# Altium schematic sheet batt_power.SchDoc: Battery and regulation
size A4; Author: Samuel López; DocumentNumber: 4; SheetNumber: 4; SheetTotal: 5
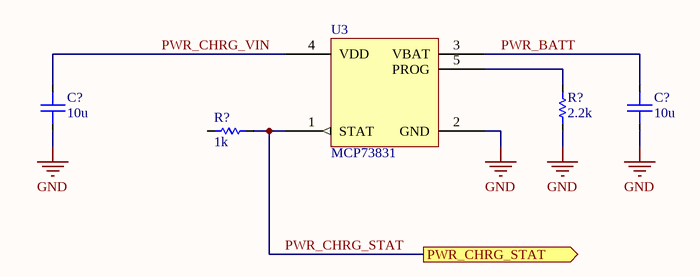
[diagram p0: batt_power.SchDoc]

## Parts
(Parts that share a designator on the sheet are numbered #1, #2 ... from top to bottom, then left to right.)
C?#1  10u  [C0603]
C?#2  10u  [C0603]
R?#1  2.2k  [R0402]
R?#2  1k  [R0402]
U3  MCP73831  [MCP7383X]

## Ports
PWR_CHRG_STAT (out)

## Nets
GND: C?#1.1 C?#2.1 R?#1.2 U3.2(GND)
PWR_BATT: C?#2.2 U3.3(VBAT)
PWR_CHRG_STAT: R?#2.1 U3.1(STAT) ; port PWR_CHRG_STAT
PWR_CHRG_VIN: C?#1.2 U3.4(VDD)
NetR?#1_1: R?#1.1 U3.5(PROG)

Not connected (* = marked no-connect by the designer): R?#2 2

## Notes on the sheet
- Title:
- Sheet
- of
- Author:
- Date:
- Time:

## Library data of the parts
C?#1 C?#2 = Capacitor: Value: 10u; Rated Voltage: *
R?#1 R?#2 = Resistor: Power: *
  R?#1: Value: 2.2k
  R?#2: Value: 1k
U3 = MCP73831: IC - Battery Charger, Single Cell Li-Ion/LiPo, 0.5A; Supplier 1: Digi-Key; Supplier Part Number 1: MCP73831T-2ACI/OTCT-ND